# Altium schematic sheet MYBOARD_03-CORE&SRAM.SchDoc
size C
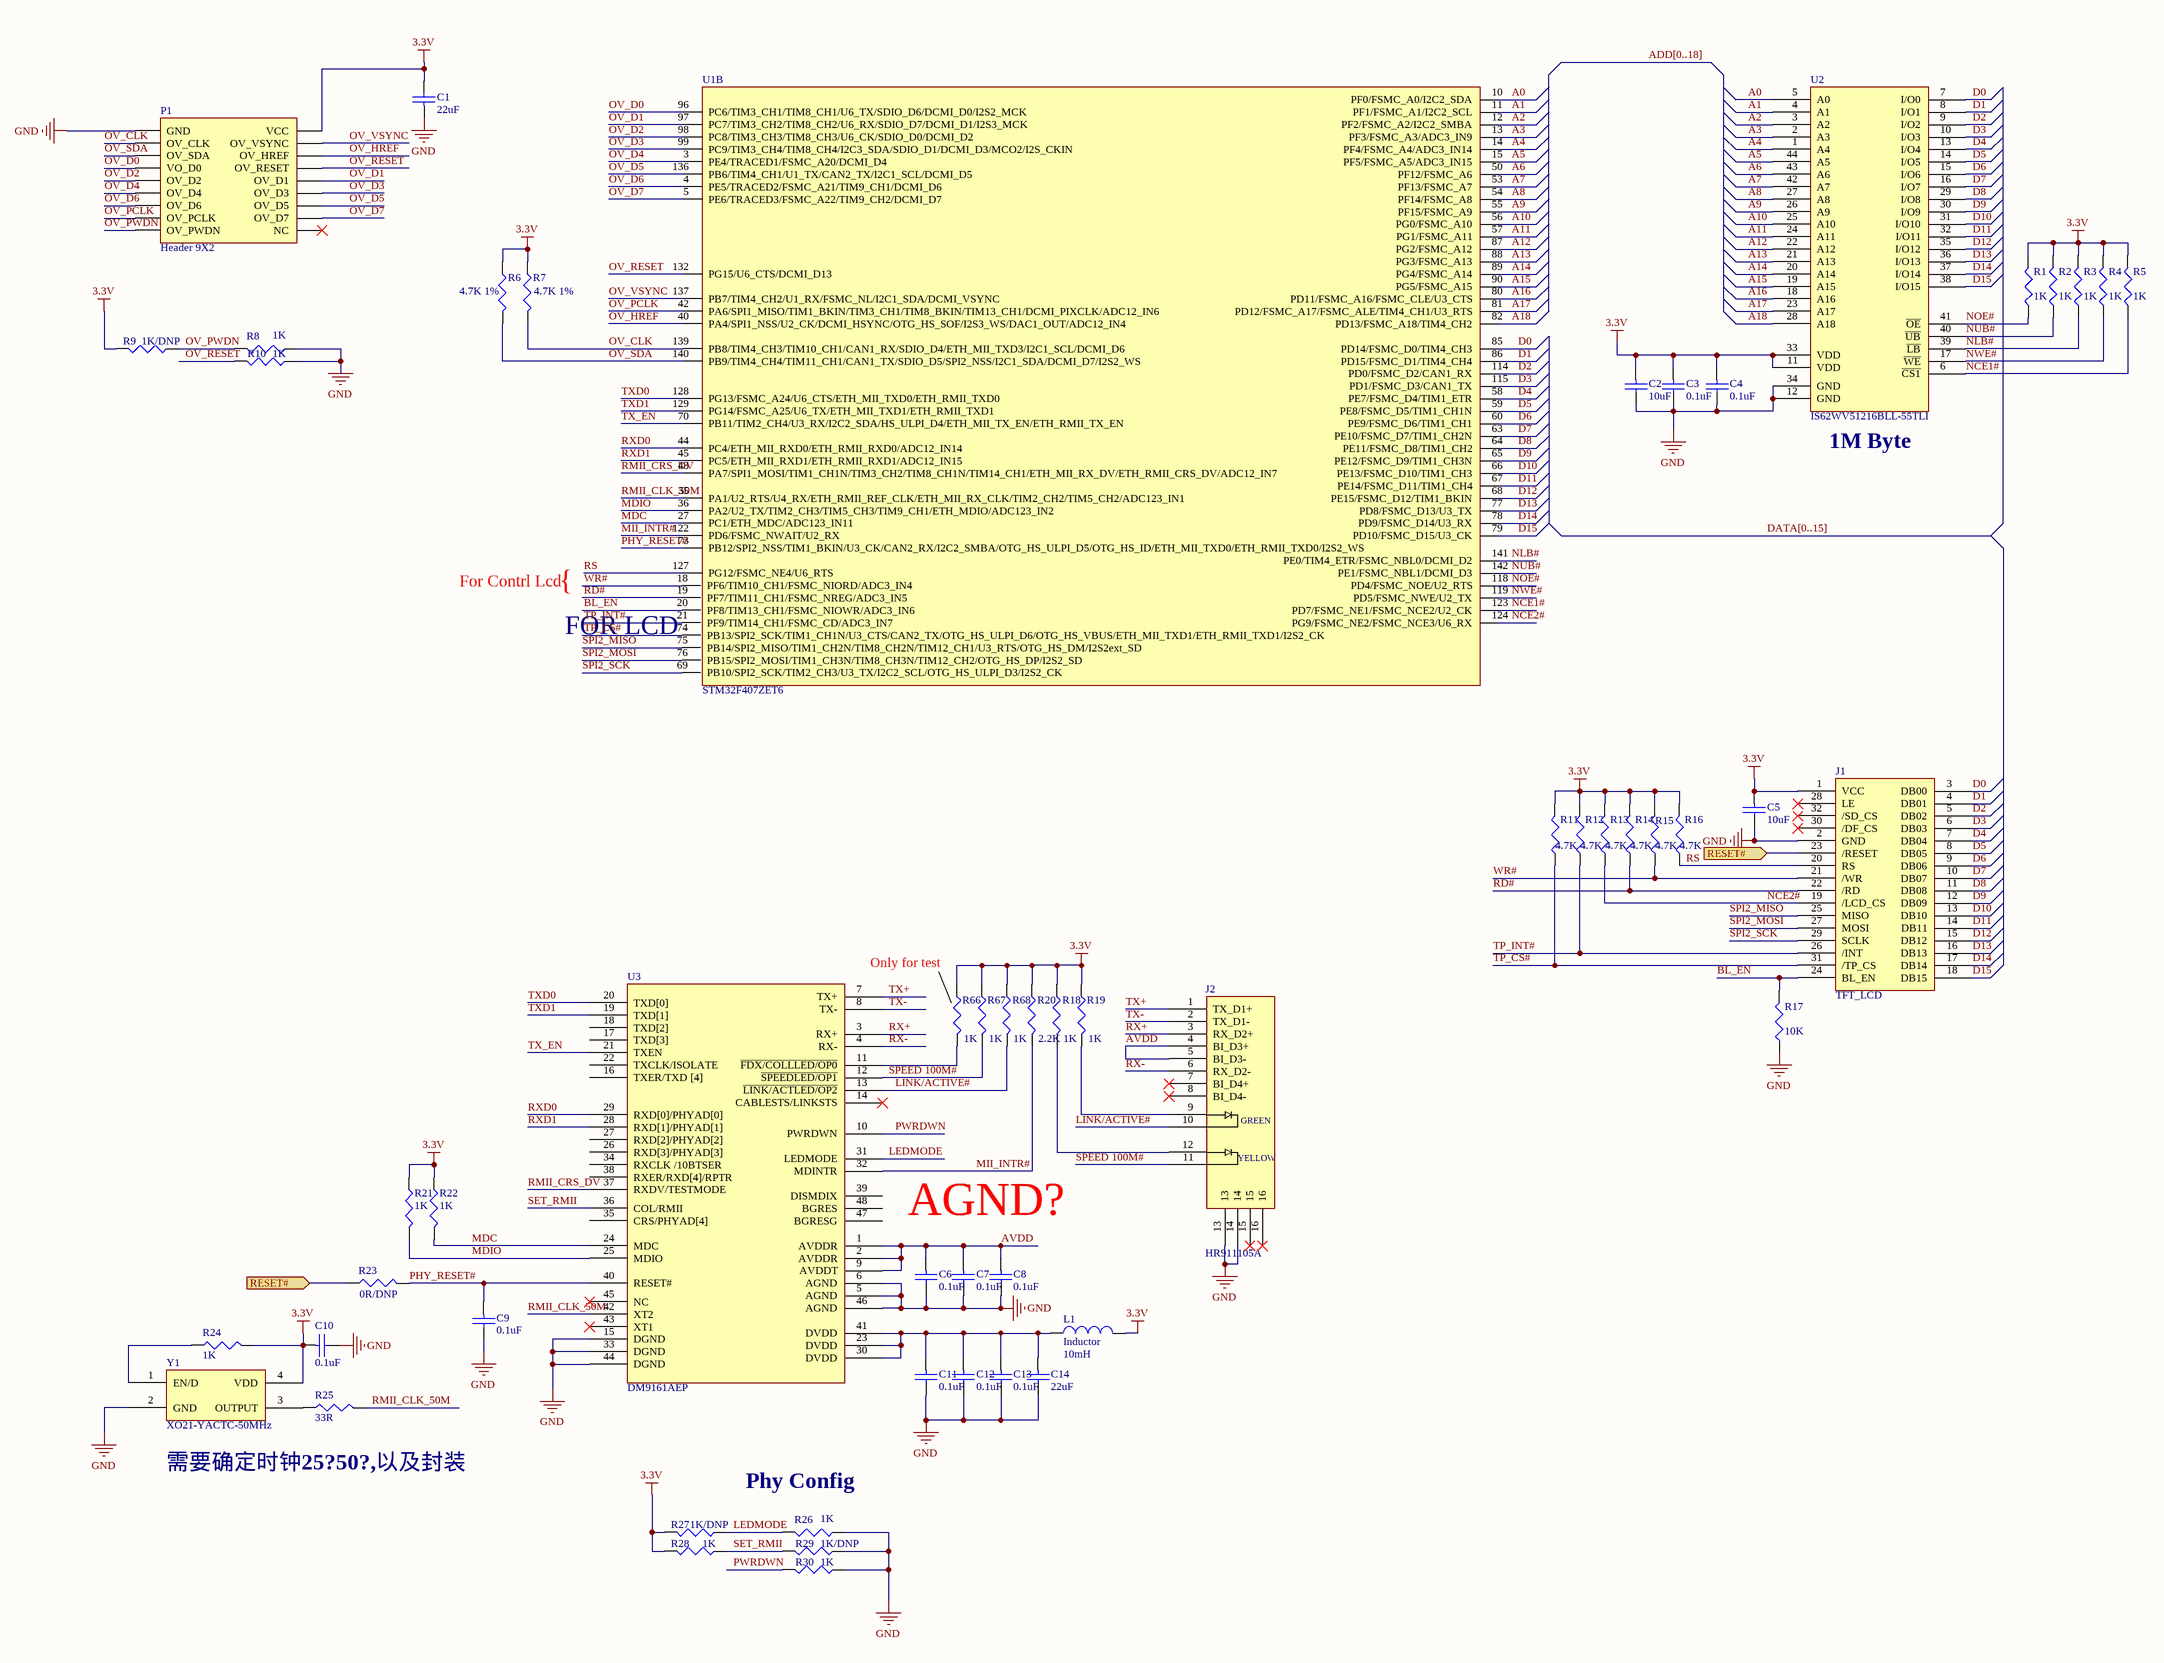
[diagram p0: MYBOARD_03-CORE&SRAM.SchDoc]

## Parts
C1  22uF  [C1206]
C2  10uF  [C0603_DWS]
C3  0.1uF  [C0603_DWS]
C4  0.1uF  [C0603_DWS]
C5  10uF  [C0603_DWS]
C6  0.1uF  [C0603_DWS]
C7  0.1uF  [C0603_DWS]
C8  0.1uF  [C0603_DWS]
C9  0.1uF  [C0603_DWS]
C10  0.1uF  [C0603_DWS]
C11  0.1uF  [C0603_DWS]
C12  0.1uF  [C0603_DWS]
C13  0.1uF  [C0603_DWS]
C14  22uF  [C1206]
J1  TFT_LCD  [TFT LCD]
J2  HR911105A  [HR911105A]
L1  Inductor  value 10mH  [0603]
P1  Header 9X2  [HDR2X9]
R1  value 1K  [R0603_5MIL_DWS]  (hidden comment: Res3)
R2  value 1K  [R0603_5MIL_DWS]  (hidden comment: Res3)
R3  value 1K  [R0603_5MIL_DWS]  (hidden comment: Res3)
R4  value 1K  [R0603_5MIL_DWS]  (hidden comment: Res3)
R5  value 1K  [R0603_5MIL_DWS]  (hidden comment: Res3)
R6  value 4.7K 1%  [R0603_5MIL_DWS]  (hidden comment: Res3)
R7  value 4.7K 1%  [R0603_5MIL_DWS]  (hidden comment: Res3)
R8  value 1K  [R0603_5MIL_DWS]  (hidden comment: Res3)
R9  value 1K/DNP  [R0603_5MIL_DWS]  (hidden comment: Res3)
R10  value 1K  [R0603_5MIL_DWS]  (hidden comment: Res3)
R11  value 4.7K  [R0603_5MIL_DWS]  (hidden comment: Res3)
R12  value 4.7K  [R0603_5MIL_DWS]  (hidden comment: Res3)
R13  value 4.7K  [R0603_5MIL_DWS]  (hidden comment: Res3)
R14  value 4.7K  [R0603_5MIL_DWS]  (hidden comment: Res3)
R15  value 4.7K  [R0603_5MIL_DWS]  (hidden comment: Res3)
R16  value 4.7K  [R0603_5MIL_DWS]  (hidden comment: Res3)
R17  value 10K  [R0603_5MIL_DWS]  (hidden comment: Res3)
R18  value 1K  [R0603_5MIL_DWS]  (hidden comment: Res3)
R19  value 1K  [R0603_5MIL_DWS]  (hidden comment: Res3)
R20  value 2.2K  [R0603_5MIL_DWS]  (hidden comment: Res3)
R21  value 1K  [R0603_5MIL_DWS]  (hidden comment: Res3)
R22  value 1K  [R0603_5MIL_DWS]  (hidden comment: Res3)
R23  value 0R/DNP  [R0603_5MIL_DWS]  (hidden comment: Res3)
R24  value 1K  [R0603_5MIL_DWS]  (hidden comment: Res3)
R25  value 33R  [R0603_5MIL_DWS]  (hidden comment: Res3)
R26  value 1K  [R0603_5MIL_DWS]  (hidden comment: Res3)
R27  value 1K/DNP  [R0603_5MIL_DWS]  (hidden comment: Res3)
R28  value 1K  [R0603_5MIL_DWS]  (hidden comment: Res3)
R29  value 1K/DNP  [R0603_5MIL_DWS]  (hidden comment: Res3)
R30  value 1K  [R0603_5MIL_DWS]  (hidden comment: Res3)
R66  value 1K  [R0603_5MIL_DWS]  (hidden comment: Res3)
R67  value 1K  [R0603_5MIL_DWS]  (hidden comment: Res3)
R68  value 1K  [R0603_5MIL_DWS]  (hidden comment: Res3)
U1  STM32F407ZET6  [LQFP144]  (part B of 3)
U2  IS62WV51216BLL-55TLI  [TSOP80P1180X120-44N]
U3  DM9161AEP  [LQFP-48]
Y1  XO21-YACTC-50MHz  [XO75]

## Ports
RESET#

## Nets
3.3V: C1.2 C2.1 C3.1 C4.1 C5.1 C10.1 J1.1(VCC) L1.2 P1.2(VCC) R1.2 R2.2 R3.2 R4.2 R5.2 R6.1 R7.1 R9.2 R11.2 R12.2 R13.2 R14.2 R15.2 R16.2 R18.1 R19.1 R20.1 R21.1 R22.1 R24.2 R27.2 R28.2 R66.1 R67.1 R68.1 U2.11(VDD) U2.33(VDD) Y1.4(VDD)
GND: C1.1 C2.2 C3.2 C4.2 C5.2 C6.2 C7.2 C8.2 C9.2 C10.2 C11.2 C12.2 C13.2 C14.2 J1.2(GND) J2.13 J2.14 P1.1(GND) R8.1 R10.1 R17.1 R26.1 R29.1 R30.1 U2.12(GND) U2.34(GND) U3.5(AGND) U3.6(AGND) U3.15(DGND) U3.33(DGND) U3.44(DGND) U3.46(AGND) Y1.2(GND)
A0: U1.10(PF0/FSMC_A0/I2C2_SDA) U2.5(A0)
A1: U1.11(PF1/FSMC_A1/I2C2_SCL) U2.4(A1)
A2: U1.12(PF2/FSMC_A2/I2C2_SMBA) U2.3(A2)
A3: U1.13(PF3/FSMC_A3/ADC3_IN9) U2.2(A3)
A4: U1.14(PF4/FSMC_A4/ADC3_IN14) U2.1(A4)
A5: U1.15(PF5/FSMC_A5/ADC3_IN15) U2.44(A5)
A6: U1.50(PF12/FSMC_A6) U2.43(A6)
A7: U1.53(PF13/FSMC_A7) U2.42(A7)
A8: U1.54(PF14/FSMC_A8) U2.27(A8)
A9: U1.55(PF15/FSMC_A9) U2.26(A9)
A10: U1.56(PG0/FSMC_A10) U2.25(A10)
A11: U1.57(PG1/FSMC_A11) U2.24(A11)
A12: U1.87(PG2/FSMC_A12) U2.22(A12)
A13: U1.88(PG3/FSMC_A13) U2.21(A13)
A14: U1.89(PG4/FSMC_A14) U2.20(A14)
A15: U1.90(PG5/FSMC_A15) U2.19(A15)
A16: U1.80(PD11/FSMC_A16/FSMC_CLE/U3_CTS) U2.18(A16)
A17: U1.81(PD12/FSMC_A17/FSMC_ALE/TIM4_CH1/U3_RTS) U2.23(A17)
A18: U1.82(PD13/FSMC_A18/TIM4_CH2) U2.28(A18)
AVDD: C6.1 C7.1 C8.1 J2.4(BI_D3+) J2.5(BI_D3-) U3.1(AVDDR) U3.2(AVDDR) U3.9(AVDDT)
BL_EN: J1.24(BL_EN) R17.2 U1.20(PF8/TIM13_CH1/FSMC_NIOWR/ADC3_IN6)
D0: J1.3(DB00) U1.85(PD14/FSMC_D0/TIM4_CH3) U2.7(I/O0)
D1: J1.4(DB01) U1.86(PD15/FSMC_D1/TIM4_CH4) U2.8(I/O1)
D2: J1.5(DB02) U1.114(PD0/FSMC_D2/CAN1_RX) U2.9(I/O2)
D3: J1.6(DB03) U1.115(PD1/FSMC_D3/CAN1_TX) U2.10(I/O3)
D4: J1.7(DB04) U1.58(PE7/FSMC_D4/TIM1_ETR) U2.13(I/O4)
D5: J1.8(DB05) U1.59(PE8/FSMC_D5/TIM1_CH1N) U2.14(I/O5)
D6: J1.9(DB06) U1.60(PE9/FSMC_D6/TIM1_CH1) U2.15(I/O6)
D7: J1.10(DB07) U1.63(PE10/FSMC_D7/TIM1_CH2N) U2.16(I/O7)
D8: J1.11(DB08) U1.64(PE11/FSMC_D8/TIM1_CH2) U2.29(I/O8)
D9: J1.12(DB09) U1.65(PE12/FSMC_D9/TIM1_CH3N) U2.30(I/O9)
D10: J1.13(DB10) U1.66(PE13/FSMC_D10/TIM1_CH3) U2.31(I/O10)
D11: J1.14(DB11) U1.67(PE14/FSMC_D11/TIM1_CH4) U2.32(I/O11)
D12: J1.15(DB12) U1.68(PE15/FSMC_D12/TIM1_BKIN) U2.35(I/O12)
D13: J1.16(DB13) U1.77(PD8/FSMC_D13/U3_TX) U2.36(I/O13)
D14: J1.17(DB14) U1.78(PD9/FSMC_D14/U3_RX) U2.37(I/O14)
D15: J1.18(DB15) U1.79(PD10/FSMC_D15/U3_CK) U2.38(I/O15)
LEDMODE: R26.2 R27.1 U3.31(LEDMODE)
LINK/ACTIVE#: J2.10 R68.2 U3.13(~{LINK/ACTLED/OP2})
MDC: R22.2 U1.27(PC1/ETH_MDC/ADC123_IN11) U3.24(MDC)
MDIO: R21.2 U1.36(PA2/U2_TX/TIM2_CH3/TIM5_CH3/TIM9_CH1/ETH_MDIO/ADC123_IN2) U3.25(MDIO)
MII_INTR#: R20.2 U1.122(PD6/FSMC_NWAIT/U2_RX) U3.32(MDINTR)
NCE1#: R5.1 U1.123(PD7/FSMC_NE1/FSMC_NCE2/U2_CK) U2.6(~{CS1})
NCE2#: J1.19(/LCD_CS) R13.1 U1.124(PG9/FSMC_NE2/FSMC_NCE3/U6_RX)
NLB#: R3.1 U1.141(PE0/TIM4_ETR/FSMC_NBL0/DCMI_D2) U2.39(~{LB})
NOE#: R1.1 U1.118(PD4/FSMC_NOE/U2_RTS) U2.41(~{OE})
NUB#: R2.1 U1.142(PE1/FSMC_NBL1/DCMI_D3) U2.40(~{UB})
NWE#: R4.1 U1.119(PD5/FSMC_NWE/U2_TX) U2.17(~{WE})
OV_CLK: P1.3(OV_CLK) R7.2 U1.139(PB8/TIM4_CH3/TIM10_CH1/CAN1_RX/SDIO_D4/ETH_MII_TXD3/I2C1_SCL/DCMI_D6)
OV_D0: P1.7(VO_D0) U1.96(PC6/TIM3_CH1/TIM8_CH1/U6_TX/SDIO_D6/DCMI_D0/I2S2_MCK)
OV_D1: P1.10(OV_D1) U1.97(PC7/TIM3_CH2/TIM8_CH2/U6_RX/SDIO_D7/DCMI_D1/I2S3_MCK)
OV_D2: P1.9(OV_D2) U1.98(PC8/TIM3_CH3/TIM8_CH3/U6_CK/SDIO_D0/DCMI_D2)
OV_D3: P1.12(OV_D3) U1.99(PC9/TIM3_CH4/TIM8_CH4/I2C3_SDA/SDIO_D1/DCMI_D3/MCO2/I2S_CKIN)
OV_D4: P1.11(OV_D4) U1.3(PE4/TRACED1/FSMC_A20/DCMI_D4)
OV_D5: P1.14(OV_D5) U1.136(PB6/TIM4_CH1/U1_TX/CAN2_TX/I2C1_SCL/DCMI_D5)
OV_D6: P1.13(OV_D6) U1.4(PE5/TRACED2/FSMC_A21/TIM9_CH1/DCMI_D6)
OV_D7: P1.16(OV_D7) U1.5(PE6/TRACED3/FSMC_A22/TIM9_CH2/DCMI_D7)
OV_HREF: P1.6(OV_HREF) U1.40(PA4/SPI1_NSS/U2_CK/DCMI_HSYNC/OTG_HS_SOF/I2S3_WS/DAC1_OUT/ADC12_IN4)
OV_PCLK: P1.15(OV_PCLK) U1.42(PA6/SPI1_MISO/TIM1_BKIN/TIM3_CH1/TIM8_BKIN/TIM13_CH1/DCMI_PIXCLK/ADC12_IN6)
OV_PWDN: P1.17(OV_PWDN) R8.2 R9.1
OV_RESET: P1.8(OV_RESET) R10.2 U1.132(PG15/U6_CTS/DCMI_D13)
OV_SDA: P1.5(OV_SDA) R6.2 U1.140(PB9/TIM4_CH4/TIM11_CH1/CAN1_TX/SDIO_D5/SPI2_NSS/I2C1_SDA/DCMI_D7/I2S2_WS)
OV_VSYNC: P1.4(OV_VSYNC) U1.137(PB7/TIM4_CH2/U1_RX/FSMC_NL/I2C1_SDA/DCMI_VSYNC)
PHY_RESET#: C9.1 R23.2 U1.73(PB12/SPI2_NSS/TIM1_BKIN/U3_CK/CAN2_RX/I2C2_SMBA/OTG_HS_ULPI_D5/OTG_HS_ID/ETH_MII_TXD0/ETH_RMII_TXD0/I2S2_WS) U3.40(RESET#)
PWRDWN: R30.2 U3.10(PWRDWN)
RD#: J1.22(/RD) R14.1 U1.19(PF7/TIM11_CH1/FSMC_NREG/ADC3_IN5)
RESET#: J1.23(/RESET) R23.1 ; port RESET#
RMII_CLK_50M: R25.2 U1.35(PA1/U2_RTS/U4_RX/ETH_RMII_REF_CLK/ETH_MII_RX_CLK/TIM2_CH2/TIM5_CH2/ADC123_IN1) U3.42(XT2)
RMII_CRS_DV: U1.43(PA7/SPI1_MOSI/TIM1_CH1N/TIM3_CH2/TIM8_CH1N/TIM14_CH1/ETH_MII_RX_DV/ETH_RMII_CRS_DV/ADC12_IN7) U3.37(RXDV/TESTMODE)
RS: J1.20(RS) R16.1 U1.127(PG12/FSMC_NE4/U6_RTS)
RX+: J2.3(RX_D2+) U3.3(RX+)
RX-: J2.6(RX_D2-) U3.4(RX-)
RXD0: U1.44(PC4/ETH_MII_RXD0/ETH_RMII_RXD0/ADC12_IN14) U3.29(RXD[0]/PHYAD[0])
RXD1: U1.45(PC5/ETH_MII_RXD1/ETH_RMII_RXD1/ADC12_IN15) U3.28(RXD[1]/PHYAD[1])
SET_RMII: R28.1 R29.2 U3.36(COL/RMII)
SPEED 100M#: J2.11 R67.2 U3.12(~{SPEEDLED/OP1})
SPI2_MISO: J1.25(MISO) U1.75(PB14/SPI2_MISO/TIM1_CH2N/TIM8_CH2N/TIM12_CH1/U3_RTS/OTG_HS_DM/I2S2ext_SD)
SPI2_MOSI: J1.27(MOSI) U1.76(PB15/SPI2_MOSI/TIM1_CH3N/TIM8_CH3N/TIM12_CH2/OTG_HS_DP/I2S2_SD)
SPI2_SCK: J1.29(SCLK) U1.69(PB10/SPI2_SCK/TIM2_CH3/U3_TX/I2C2_SCL/OTG_HS_ULPI_D3/I2S2_CK)
TP_CS#: J1.31(/TP_CS) R11.1 U1.74(PB13/SPI2_SCK/TIM1_CH1N/U3_CTS/CAN2_TX/OTG_HS_ULPI_D6/OTG_HS_VBUS/ETH_MII_TXD1/ETH_RMII_TXD1/I2S2_CK)
TP_INT#: J1.26(/INT) R12.1 U1.21(PF9/TIM14_CH1/FSMC_CD/ADC3_IN7)
TX+: J2.1(TX_D1+) U3.7(TX+)
TX-: J2.2(TX_D1-) U3.8(TX-)
TX_EN: U1.70(PB11/TIM2_CH4/U3_RX/I2C2_SDA/HS_ULPI_D4/ETH_MII_TX_EN/ETH_RMII_TX_EN) U3.21(TXEN)
TXD0: U1.128(PG13/FSMC_A24/U6_CTS/ETH_MII_TXD0/ETH_RMII_TXD0) U3.20(TXD[0])
TXD1: U1.129(PG14/FSMC_A25/U6_TX/ETH_MII_TXD1/ETH_RMII_TXD1) U3.19(TXD[1])
WR#: J1.21(/WR) R15.1 U1.18(PF6/TIM10_CH1/FSMC_NIORD/ADC3_IN4)
NetC11_1: C11.1 C12.1 C13.1 C14.1 L1.1 U3.23(DVDD) U3.30(DVDD) U3.41(DVDD)
NetJ2_9: J2.9 R19.2
NetJ2_12: J2.12 R18.2
NetR24_1: R24.1 Y1.1(EN/D)
NetR25_1: R25.1 Y1.3(OUTPUT)
NetR66_2: R66.2 U3.11(~{FDX/COLLLED/}~{OP0})

Not connected (* = marked no-connect by the designer): J1 28(LE)* 30(/DF_CS)* 32(/SD_CS)*; J2 7(BI_D4+)* 8(BI_D4-)* 15* 16*; P1 18(NC)*; U3 14(CABLESTS/LINKSTS)* 16(TXER/TXD_[4]) 17(TXD[3]) 18(TXD[2]) 22(TXCLK/ISOLATE) 26(RXD[3]/PHYAD[3]) 27(RXD[2]/PHYAD[2]) 34(RXCLK_/10BTSER) 35(CRS/PHYAD[4]) 38(RXER/RXD[4]/RPTR) 39(DISMDIX) 43(XT1)* 45(NC)* 47(BGRESG) 48(BGRES)

## Buses and harness runs
bus ADD[0..18]
bus DATA[0..15]

## Notes on the sheet
- (near U2) 1M Byte
- For Contrl Lcd
- {
- FOR LCD
- Only for test
- AGND?
- 需要确定时钟25?50?,以及封装
- Phy Config
- (in symbol RJ45,10/100 Base -TX,有变压器) GREEN; YELLOW

## Library data of the parts
C1-C14 = CAP: Capacitor
J1 = TFT_LCD: 320x240,32PIN,
J2 = RJ45,10/100 Base -TX,有变压器
L1 = Inductor: Code_IEC: 1005; Published: 8-Jun-2000; LatestRevisionDate: 29-May-2009; LatestRevisionNote: IPC-7351 Footprint Added.; PackageReference: 0402-A; Publisher: Altium Limited; PackageDescription: Chip Inductor; Code_JEITA: 0402
P1 = Header 9X2: Header, 9-Pin, Dual row; LatestRevisionDate: 17-Jul-2002; LatestRevisionNote: Re-released for DXP Platform.; Publisher: Altium Limited
R1-R30 R66-R68 = Res3: Resistor; Published: 8-Jun-2000; LatestRevisionDate: 29-May-2009; LatestRevisionNote: IPC-7351 Footprint Added.; PackageReference: J1-0603; Publisher: Altium Limited; PackageDescription: Chip Resistor
Y1 = Oscillator: 3.3V,Crystal Oscillator,25M,,Size 2.05×1.65×0.85 mm